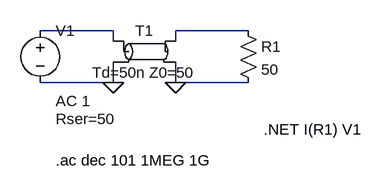
[diagram p0: schematic Draft2.asc]
Draft2.asc, the LTspice schematic file:
Version 4
SHEET 1 880 680
WIRE 192 112 80 112
WIRE 400 112 288 112
WIRE 192 128 192 112
WIRE 288 128 288 112
WIRE 192 192 192 160
WIRE 192 192 80 192
WIRE 288 192 288 160
WIRE 400 192 288 192
FLAG 192 192 0
FLAG 288 192 0
SYMBOL voltage 80 96 R0
WINDOW 123 24 124 Left 2
WINDOW 39 24 152 Left 2
SYMATTR InstName V1
SYMATTR Value ""
SYMATTR Value2 AC 1
SYMATTR SpiceLine Rser=50
SYMBOL tline 240 144 R0
SYMATTR InstName T1
SYMBOL res 384 96 R0
SYMATTR InstName R1
SYMATTR Value 50
TEXT 104 312 Left 2 !.ac dec 101 1MEG 1G
TEXT 424 264 Left 2 !.NET I(R1) V1

The netlist it stands for:
* Draft2.asc
V1 N001 0 AC 1 Rser=50
T1 N001 0 N002 0 Td=50n Z0=50
R1 N002 0 50
.ac dec 101 1MEG 1G
.NET I(R1) V1
.backanno
.end